# EAGLE design vca2 (EAGLE 9.4.2)
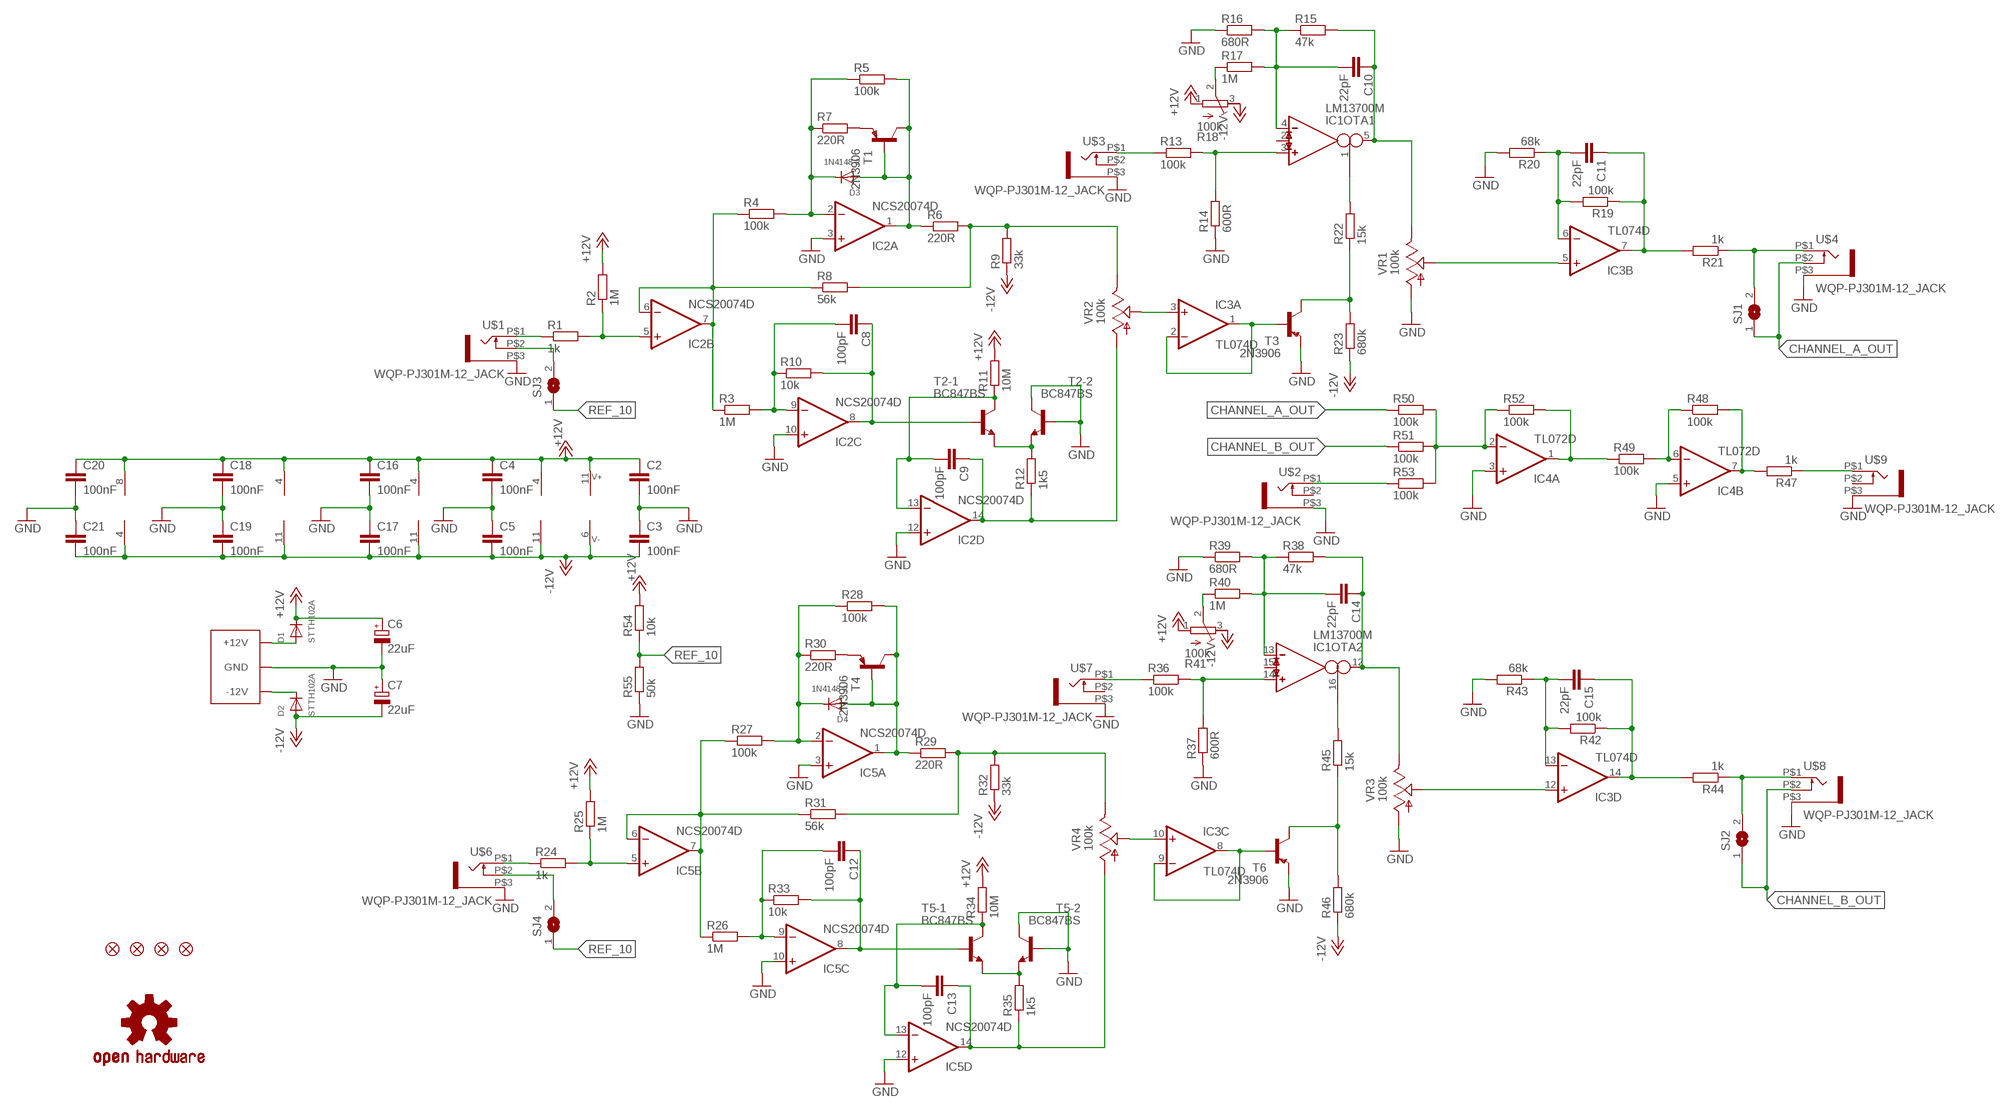
[diagram p0: schematic, sheet 1]

## Parts
C1  EURO_POWER_LOCKFAT-LOCK  [EURO_PWR_HEADER_LOCK]
C2  100nF  C-EUC0603  [C0603]
C3  100nF  C-EUC0603  [C0603]
C4  100nF  C-EUC0603  [C0603]
C5  100nF  C-EUC0603  [C0603]
C6  22uF  CPOL-EUC  [PANASONIC_C]
C7  22uF  CPOL-EUC  [PANASONIC_C]
C8  100pF  C-EUC0603  [C0603]
C9  100pF  C-EUC0603  [C0603]
C10  22pF  C-EUC0603  [C0603]
C11  22pF  C-EUC0603  [C0603]
C12  100pF  C-EUC0603  [C0603]
C13  100pF  C-EUC0603  [C0603]
C14  22pF  C-EUC0603  [C0603]
C15  22pF  C-EUC0603  [C0603]
C16  100nF  C-EUC0603  [C0603]
C17  100nF  C-EUC0603  [C0603]
C18  100nF  C-EUC0603  [C0603]
C19  100nF  C-EUC0603  [C0603]
C20  100nF  C-EUC0603  [C0603]
C21  100nF  C-EUC0603  [C0603]
D1  STTH102A  DIODESMA  [SMADIODE]
D2  STTH102A  DIODESMA  [SMADIODE]
D3  1N4148-2  DIODESOD-123  [SOD-123]
D4  1N4148-2  DIODESOD-123  [SOD-123]
FD1  FIDUCIAL1X2  [FIDUCIAL-1X2]
FD2  FIDUCIAL1X2  [FIDUCIAL-1X2]
FD3  FIDUCIAL1X2  [FIDUCIAL-1X2]
FD4  FIDUCIAL1X2  [FIDUCIAL-1X2]
IC1  LM13700M  [SO16]
IC2  NCS20074D  [SO14]
IC3  TL074D  [SO14]
IC4  TL072D  [SO08]
IC5  NCS20074D  [SO14]
LOGO1  OSHW-LOGOM  [OSHW-LOGO-M]
R1  1k  R-EU_R0603  [R0603]
R2  1M  R-EU_R0603  [R0603]
R3  1M  R-EU_R0603  [R0603]
R4  100k  R-EU_R0603  [R0603]
R5  100k  R-EU_R0603  [R0603]
R6  220R  R-EU_R0603  [R0603]
R7  220R  R-EU_R0603  [R0603]
R8  56k  R-EU_R0603  [R0603]
R9  33k  R-EU_R0603  [R0603]
R10  10k  R-EU_R0603  [R0603]
R11  10M  R-EU_R0603  [R0603]
R12  1k5  R-EU_R0603  [R0603]
R13  100k  R-EU_R0603  [R0603]
R14  600R  R-EU_R0603  [R0603]
R15  47k  R-EU_R0603  [R0603]
R16  680R  R-EU_R0603  [R0603]
R17  1M  R-EU_R0603  [R0603]
R18  100k  R-TRIMM64W  [RTRIM64W]
R19  100k  R-EU_R0603  [R0603]
R20  68k  R-EU_R0603  [R0603]
R21  1k  R-EU_R0603  [R0603]
R22  15k  R-EU_R0603  [R0603]
R23  680k  R-EU_R0603  [R0603]
R24  1k  R-EU_R0603  [R0603]
R25  1M  R-EU_R0603  [R0603]
R26  1M  R-EU_R0603  [R0603]
R27  100k  R-EU_R0603  [R0603]
R28  100k  R-EU_R0603  [R0603]
R29  220R  R-EU_R0603  [R0603]
R30  220R  R-EU_R0603  [R0603]
R31  56k  R-EU_R0603  [R0603]
R32  33k  R-EU_R0603  [R0603]
R33  10k  R-EU_R0603  [R0603]
R34  10M  R-EU_R0603  [R0603]
R35  1k5  R-EU_R0603  [R0603]
R36  100k  R-EU_R0603  [R0603]
R37  600R  R-EU_R0603  [R0603]
R38  47k  R-EU_R0603  [R0603]
R39  680R  R-EU_R0603  [R0603]
R40  1M  R-EU_R0603  [R0603]
R41  100k  R-TRIMM64W  [RTRIM64W]
R42  100k  R-EU_R0603  [R0603]
R43  68k  R-EU_R0603  [R0603]
R44  1k  R-EU_R0603  [R0603]
R45  15k  R-EU_R0603  [R0603]
R46  680k  R-EU_R0603  [R0603]
R47  1k  R-EU_R0603  [R0603]
R48  100k  R-EU_R0603  [R0603]
R49  100k  R-EU_R0603  [R0603]
R50  100k  R-EU_R0603  [R0603]
R51  100k  R-EU_R0603  [R0603]
R52  100k  R-EU_R0603  [R0603]
R53  100k  R-EU_R0603  [R0603]
R54  10k  R-EU_R0603  [R0603]
R55  50k  R-EU_R0603  [R0603]
SJ1  SJ  [SJ]
SJ2  SJ  [SJ]
SJ3  SJ  [SJ]
SJ4  SJ  [SJ]
T1  2N3906  MMBT3906LT1-PNP-SOT23-BEC  [SOT23-BEC]
T2  BC847BS  [SOT363]
T3  2N3906  MMBT3906LT1-PNP-SOT23-BEC  [SOT23-BEC]
T4  2N3906  MMBT3906LT1-PNP-SOT23-BEC  [SOT23-BEC]
T5  BC847BS  [SOT363]
T6  2N3906  MMBT3906LT1-PNP-SOT23-BEC  [SOT23-BEC]
U$1  WQP-PJ301M-12_JACK  [WQP-PJ301M-12_JACK]
U$2  WQP-PJ301M-12_JACK  [WQP-PJ301M-12_JACK]
U$3  WQP-PJ301M-12_JACK  [WQP-PJ301M-12_JACK]
U$4  WQP-PJ301M-12_JACK  [WQP-PJ301M-12_JACK]
U$6  WQP-PJ301M-12_JACK  [WQP-PJ301M-12_JACK]
U$7  WQP-PJ301M-12_JACK  [WQP-PJ301M-12_JACK]
U$8  WQP-PJ301M-12_JACK  [WQP-PJ301M-12_JACK]
U$9  WQP-PJ301M-12_JACK  [WQP-PJ301M-12_JACK]
VR1  100k  9MM_SNAP-IN_POT_  [9MM_SNAP-IN_POT]
VR2  100k  9MM_SNAP-IN_POT_  [9MM_SNAP-IN_POT]
VR3  100k  9MM_SNAP-IN_POT_  [9MM_SNAP-IN_POT]
VR4  100k  9MM_SNAP-IN_POT_  [9MM_SNAP-IN_POT]

## Nets
+12V [power]: C2.1 C4.1 C6.+ C16.1 C18.1 C20.1 D1.C IC1.11(SUPPLY:V+) IC2.4(P:V+) IC3.4(P:V+) IC4.8(P:V+) IC5.4(P:V+) R2.2 R11.2 R18.1(A) R25.2 R34.2 R41.1(A) R54.2
-12V [power]: C3.2 C5.2 C7.- C17.2 C19.2 C21.2 D2.A IC1.6(SUPPLY:V-) IC2.11(P:V-) IC3.11(P:V-) IC4.4(P:V-) IC5.11(P:V-) R9.1 R18.3(E) R23.1 R32.1 R41.3(E) R46.1
CHANNEL_A: R21.1 SJ1.2 U$4.P$1
CHANNEL_A_OUT: R50.1 SJ1.1 U$4.P$2
CHANNEL_B: R44.1 SJ2.2 U$8.P$1
CHANNEL_B_OUT: R51.1 SJ2.1 U$8.P$2
GND [power]: C1.GND1(GND) C1.GND2(GND) C1.GND3(GND) C1.GND4(GND) C1.GND5(GND) C1.GND6(GND) C2.2 C3.1 C4.2 C5.1 C6.- C7.+ C16.2 C17.1 C18.2 C19.1 C20.2 C21.1 IC2.3(A:+IN) IC2.10(C:+IN) IC2.12(D:+IN) IC4.3(A:+IN) IC4.5(B:+IN) IC5.3(A:+IN) IC5.10(C:+IN) IC5.12(D:+IN) R14.1 R16.1 R20.2 R37.1 R39.1 R43.2 R55.1 T2.3(-2:C) T2.5(-2:B) T3.E T5.3(-2:C) T5.5(-2:B) T6.E U$1.P$3 U$2.P$3 U$3.P$3 U$4.P$3 U$6.P$3 U$7.P$3 U$8.P$3 U$9.P$3 VR1.1(A) VR3.1(A)
N$1: IC2.5(B:+IN) R1.2 R2.1
N$2: C8.2 IC2.9(C:-IN) R3.2 R10.1
N$3: IC2.6(B:-IN) IC2.7(B:OUT) R3.1 R4.1 R8.1
N$4: R1.1 U$1.P$1
N$5: C8.1 IC2.8(C:OUT) R10.2 T2.2(-1:B)
N$6: C9.2 IC2.13(D:-IN) R11.1 T2.6(-1:C)
N$7: R6.2 R8.2 R9.2 VR2.3(E)
N$8: R7.2 T1.E
N$9: D3.A IC2.1(A:OUT) R5.2 R6.1 T1.B T1.C
N$10: C10.2 IC1.4(OTA1:IN_N) R15.1 R16.2 R17.2
N$11: D3.C IC2.2(A:-IN) R4.2 R5.1 R7.1
N$12: R12.2 T2.1(-1:E) T2.4(-2:E)
N$13: C9.1 IC2.14(D:OUT) R12.1 VR2.1(A)
N$14: R13.1 U$3.P$1
N$15: IC1.3(OTA1:IN_P) R13.2 R14.2
N$16: R47.1 U$9.P$1
N$17: C10.1 IC1.5(OTA1:OUT) R15.2 VR1.3(E)
N$18: R17.1 R18.2(S)
N$19: IC3.5(B:+IN) VR1.2(S)
N$20: C11.2 IC3.6(B:-IN) R19.2 R20.1
N$21: IC5.5(B:+IN) R24.2 R25.1
N$22: C11.1 IC3.7(B:OUT) R19.1 R21.2
N$23: IC3.1(A:OUT) IC3.2(A:-IN) T3.B
N$24: IC3.3(A:+IN) VR2.2(S)
N$25: IC1.1(OTA1:I_BIAS) R22.2
N$26: R22.1 R23.2 T3.C
N$27: C12.2 IC5.9(C:-IN) R26.2 R33.1
N$28: IC5.6(B:-IN) IC5.7(B:OUT) R26.1 R27.1 R31.1
N$29: R24.1 U$6.P$1
N$30: R29.2 R31.2 R32.2 VR4.3(E)
N$31: R30.2 T4.E
N$32: D4.A IC5.1(A:OUT) R28.2 R29.1 T4.B T4.C
N$33: D4.C IC5.2(A:-IN) R27.2 R28.1 R30.1
N$34: C12.1 IC5.8(C:OUT) R33.2 T5.2(-1:B)
N$35: R35.2 T5.1(-1:E) T5.4(-2:E)
N$36: C13.2 IC5.13(D:-IN) R34.1 T5.6(-1:C)
N$37: C13.1 IC5.14(D:OUT) R35.1 VR4.1(A)
N$38: R36.1 U$7.P$1
N$39: IC1.14(OTA2:IN_P) R36.2 R37.2
N$40: C14.2 IC1.13(OTA2:IN_N) R38.1 R39.2 R40.2
N$41 [power]: C1.NEG1(-12V) C1.NEG2(-12V) D2.C
N$42 [power]: C1.POS1(+12V) C1.POS2(+12V) D1.A
N$43: C14.1 IC1.12(OTA2:OUT) R38.2 VR3.3(E)
N$44: R40.1 R41.2(S)
N$45: C15.2 IC3.13(D:-IN) R42.2 R43.1
N$46: IC3.12(D:+IN) VR3.2(S)
N$47: C15.1 IC3.14(D:OUT) R42.1 R44.2
N$48: IC4.6(B:-IN) R48.1 R49.2
N$49: IC3.8(C:OUT) IC3.9(C:-IN) T6.B
N$50: IC3.10(C:+IN) VR4.2(S)
N$51: IC1.16(OTA2:I_BIAS) R45.2
N$52: R45.1 R46.2 T6.C
N$53: IC4.1(A:OUT) R49.1 R52.2
N$54: IC4.7(B:OUT) R47.2 R48.2
N$55: IC4.2(A:-IN) R50.2 R51.2 R52.1 R53.2
N$56: SJ3.2 U$1.P$2
N$57: R53.1 U$2.P$1
N$58: SJ4.2 U$6.P$2
REF_10: R54.1 R55.2 SJ3.1 SJ4.1
Unconnected: IC1.2(OTA1:I_DIODE) IC1.7(BUF1:B) IC1.8(BUF1:E) IC1.9(BUF2:E) IC1.10(BUF2:B) IC1.15(OTA2:I_DIODE) U$2.P$2 U$3.P$2 U$7.P$2 U$9.P$2

## Library data of the parts
C1 = MusicThingModular:EURO_POWER_LOCK
C2-C5 C8-C21 = rcl:C-EU: CAPACITOR, European symbol; SPICEPREFIX: C
C6 C7 = rcl:CPOL-EU: POLARIZED CAPACITOR, European symbol; SPICEPREFIX: C
D1-D4 = adafruit:DIODE: Diode SMADIODE - SMA Surface Mount Package 20V 1A Schottky Diode Digikey: 641-1014-6-ND DO-1N4148 - Through Hole Small Current Diode SOD-123 20V 1 A (.5mV Vf) Schottky Diode - Digikey: MBRX120TPMSCT-ND SOD-323 10V 570mA (.38mV Vf, 3ns) Schottky Diode - Digikey: ZLLS410CT-ND SOD-523 30V 30mA Schottky Diode (RB751S-40TE61) - Digikey: RB751S-40TE61CT-ND SOT23-R/W - SOT23 Package (R = Solder Paste/Reflow Ovens, W = Hand-Soldering) BAT54Film 40V 300mA - Digikey: 497-7162-1-ND
FD1-FD4 = SparkFun-Aesthetics:FIDUCIAL: Fiducial Alignment Points Point-of-reference for pick-and-place machines and other optical instruments.
IC1 = ota:LM13700: Dual OTA with buffers
IC2 IC5 = ncs20074:NCS20074: OP AMP
IC3 = linear:TL074: OP AMP
IC4 = linear:TL072: OP AMP
LOGO1 = SparkFun-Aesthetics:OSHW-LOGO: Open-Source Hardware (OSHW) Logo This logo indicates the piece of hardware it is found on incorporates a OSHW license and/or adheres to the definition of open source hardware found here: http://freedomdefined.org/OSHW
R1-R17 R19-R40 R42-R55 = rcl:R-EU_: RESISTOR, European symbol; SPICEPREFIX: R
R18 R41 = rcl:R-TRIMM: Trimm resistor; SPICEMODEL: X; SPICEPREFIXL: POT
SJ1-SJ4 = jumper:SJ: SMD solder JUMPER
T1 T3 T4 T6 = transistor-neu-to92:*-PNP-: PNP Transistror
T2 T5 = nxp_60:BC847BS: NPN/NPN general-purpose transistor pair in a very small SOT363 (SC-88) Surface-Mounted Device (SMD) plastic package. AAL Eindhoven MK
U$1-U$4 U$6-U$9 = thonkiconn:WQP-PJ301M-12_JACK
VR1-VR4 = MusicThingModular:9MM_SNAP-IN_POT: 9mm vertical snap-in pot, Alpha / Panasonic style

## Net classes
1 power: width 0.381 mm

## Board
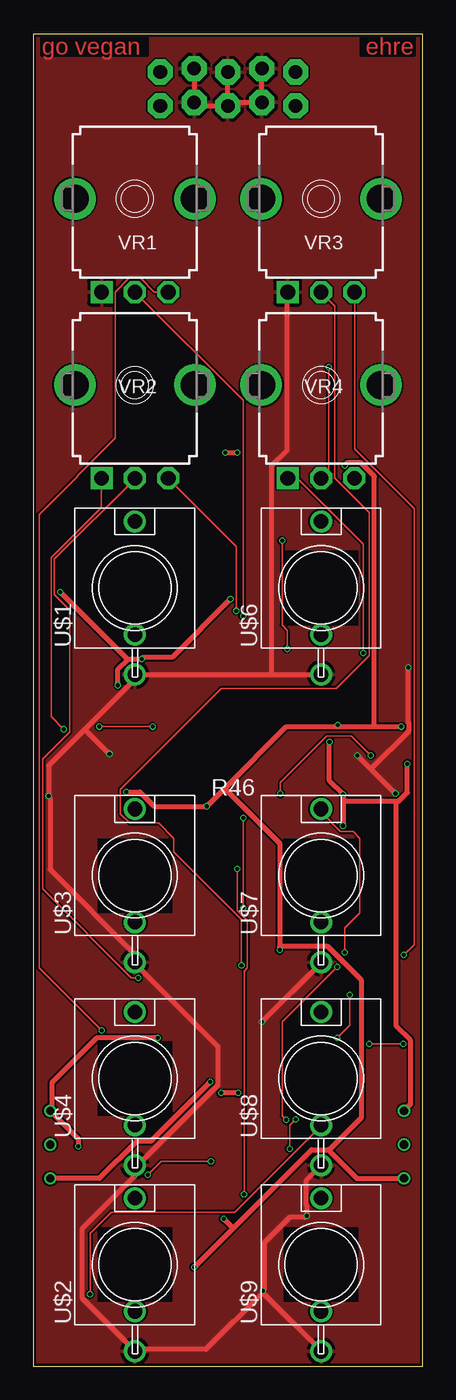
[diagram p1: board, top side]
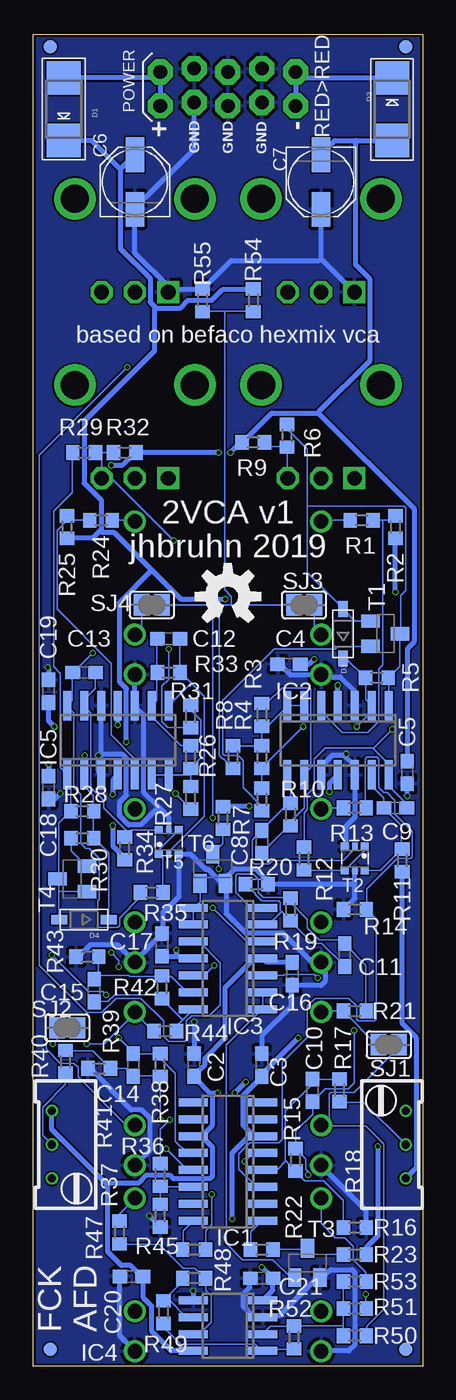
[diagram p2: board, bottom side, seen from below]

Size 29.21 x 100 mm. Coordinates in mm from the lower left corner, seen from the top.
Outline: 0,0 29.21,0 29.21,100 0,100 0,0
Copper layers (1*16): Top 0.035559375mm / dielectric 1.6mm / Bottom 0.035559375mm
Design rules "jlcpcb2layer": minimum track width 5mil, minimum drill 12mil, track to track 5mil, track to pad 5mil, pad to pad 5mil, via to via 5mil, smd to smd 5mil, copper to edge 8mil, drill to drill 6mil, minimum pad ring 5mil, minimum via ring 3mil, stop-mask expansion 2.5mil, vias tented up to drill 0mil, thermal gap 10mil

### Footprints (pad centres in the part's own frame; a part is rotated, then mirrored left to right if it is on the bottom)
EURO_PWR_HEADER_LOCK = drill 1.016 pad 1.88 octagon: GND1 -2.54,1.143; GND2 -2.54,-1.397; GND3 0,1.397; GND4 0,-1.143; GND5 2.54,1.143; GND6 2.54,-1.397; NEG1 -5.08,1.397; NEG2 -5.08,-1.143; POS1 5.08,1.397; POS2 5.08,-1.143
C0603 = smd 1.1 x 1: 1 -0.85,0; 2 0.85,0
PANASONIC_C = smd 2.6 x 1.4: + 2.05,0; - -2.05,0
SMADIODE = smd 2.54 x 2.54: A 2.349,0; C -2.349,0
SOD-123 = smd 1.2 x 0.7: A 1.85,0; C -1.85,0
FIDUCIAL-1X2 = smd 1 x 1: 1 0,0
SO16 = smd 0.6 x 2.2: 1 -4.445,-2.6; 2 -3.175,-2.6; 3 -1.905,-2.6; 4 -0.635,-2.6; 5 0.635,-2.6; 6 1.905,-2.6; 7 3.175,-2.6; 8 4.445,-2.6; 9 4.445,2.6; 10 3.175,2.6; 11 1.905,2.6; 12 0.635,2.6; 13 -0.635,2.6; 14 -1.905,2.6; 15 -3.175,2.6; 16 -4.445,2.6
SO14 = smd 0.6 x 2.2: 1 -3.81,-2.6; 2 -2.54,-2.6; 3 -1.27,-2.6; 4 0,-2.6; 5 1.27,-2.6; 6 2.54,-2.6; 7 3.81,-2.6; 8 3.81,2.6; 9 2.54,2.6; 10 1.27,2.6; 11 0,2.6; 12 -1.27,2.6; 13 -2.54,2.6; 14 -3.81,2.6
SO08 = smd 0.6 x 2.2: 1 -1.905,-2.6; 2 -0.635,-2.6; 3 0.635,-2.6; 4 1.905,-2.6; 5 1.905,2.6; 6 0.635,2.6; 7 -0.635,2.6; 8 -1.905,2.6
R0603 = smd 1 x 1.1: 1 -0.85,0; 2 0.85,0
RTRIM64W = drill 0.61: 1 1.27,-2.54; 2 1.27,0; 3 1.27,2.54
SJ = smd 1.168 x 1.6: 1 -0.762,0; 2 0.762,0
SOT23-BEC = smd 1 x 1.4: B -0.95,-1.1; C 0,1.1; E 0.95,-1.1
SOT363 = smd 0.6 x 0.6: 1 -0.75,-0.9; 3 0.75,-0.9; 4 0.75,0.9; 6 -0.75,0.9 | smd 0.4 x 0.6: 2 0,-0.9; 5 0,0.9
WQP-PJ301M-12_JACK = drill 1.1: P$1 0,5; P$2 0,-3.5; P$3 0,-6.5
9MM_SNAP-IN_POT = drill 1.1 square: 1 -2.5,-7 | drill 1.1 octagon: 2 0,-7; 3 2.5,-7 | drill 2.1 pad 2.794: CHASSIS1 -4.5,0; CHASSIS2 4.5,0

### Placement (x,y rotation side)
C1  14.61,96.01 180 bottom
C2  17.14,22.61 90 bottom
C3  12.06,22.61 270 bottom
C4  10.03,52.7 180 bottom
C5  1.14,44.58 90 bottom
C6  21.59,88.9 90 bottom
C7  7.62,88.9 270 bottom
C8  12.06,39.37 270 bottom
C9  2.03,41.91 180 bottom
C10  8.26,20.7 90 bottom
C11  5.84,30.86 270 bottom
C12  19.05,54.61 180 bottom
C13  25.4,52.07 0 bottom
C14  21.72,22.61 270 bottom
C15  24.64,28.19 90 bottom
C16  9.78,29.46 270 bottom
C17  19.56,31.62 270 bottom
C18  28.07,43.43 270 bottom
C19  28.07,50.67 270 bottom
C20  21.84,6.73 180 bottom
C21  12.06,6.6 0 bottom
D1  26.92,94.36 90 bottom
D2  2.29,94.36 270 bottom
D3  5.97,54.99 90 bottom
D4  25.4,33.53 180 bottom
FD1  1.27,99.06 0 bottom
FD2  27.94,99.06 0 bottom
FD3  1.27,1.27 0 bottom
FD4  27.94,1.27 0 bottom
IC1  14.61,15.37 90 bottom
IC2  6.35,46.99 180 bottom
IC3  14.61,30.61 90 bottom
IC4  14.61,3.05 90 bottom
IC5  22.86,46.99 0 bottom
LOGO1  14.61,57.78 0 bottom
R1  4.57,63.5 0 bottom
R2  2.03,62.99 270 bottom
R3  12.06,48.9 90 bottom
R4  12.06,45.72 270 bottom
R5  3.43,51.69 0 bottom
R6  10.16,69.85 270 bottom
R7  12.06,42.55 270 bottom
R8  14.22,45.72 270 bottom
R9  12.7,69.34 0 bottom
R10  9.91,41.4 90 bottom
R11  1.52,37.97 270 bottom
R12  8.89,38.1 270 bottom
R13  5.08,41.91 0 bottom
R14  5.08,34.29 0 bottom
R15  9.53,15.49 90 bottom
R16  5.08,10.41 180 bottom
R17  6.22,20.7 90 bottom
R18  2.54,16.64 0 bottom
R19  9.91,34.29 270 bottom
R20  12.45,36.2 0 bottom
R21  5.08,26.67 0 bottom
R22  12.06,8.76 180 bottom
R23  5.08,8.38 180 bottom
R24  24.13,63.5 180 bottom
R25  26.67,62.99 270 bottom
R26  17.4,45.72 90 bottom
R27  17.4,42.67 270 bottom
R28  25.53,41.66 180 bottom
R29  25.4,68.58 0 bottom
R30  25.53,39.62 180 bottom
R31  17.4,48.77 270 bottom
R32  22.35,68.58 180 bottom
R33  19.05,52.07 0 bottom
R34  22.35,38.86 270 bottom
R35  20.32,35.56 0 bottom
R36  19.68,14.35 270 bottom
R37  19.68,11.3 90 bottom
R38  19.68,22.61 90 bottom
R39  24.26,22.35 0 bottom
R40  26.8,22.86 90 bottom
R41  26.54,16.64 180 bottom
R42  19.56,28.45 90 bottom
R43  25.15,30.73 180 bottom
R44  19.3,25.15 0 bottom
R45  17.14,8.76 180 bottom
R46  14.99,41.15 270 bottom
R47  22.73,10.03 270 bottom
R48  17.14,6.6 0 bottom
R49  19.43,4.06 90 bottom
R50  5.08,2.29 180 bottom
R51  5.08,4.32 180 bottom
R52  9.65,2.16 270 bottom
R53  5.08,6.35 180 bottom
R54  12.7,80.01 90 bottom
R55  16.51,80.01 270 bottom
SJ1  2.54,24.13 180 bottom
SJ2  26.67,25.4 180 bottom
SJ3  8.89,57.15 0 bottom
SJ4  20.32,57.15 180 bottom
T1  2.79,54.99 270 bottom
T2  5.08,38.1 180 bottom
T3  8.64,7.75 0 bottom
T4  26.29,36.58 90 bottom
T5  19.05,39.37 0 bottom
T6  15.75,37.34 0 bottom
U$1  7.62,58.42 0 top
U$2  7.62,7.62 0 top
U$3  7.62,36.83 0 top
U$4  7.62,21.59 0 top
U$6  21.59,58.42 0 top
U$7  21.59,36.83 0 top
U$8  21.59,21.59 0 top
U$9  21.59,7.62 0 top
VR1  7.62,87.63 0 top
VR2  7.62,73.66 0 top
VR3  21.59,87.63 0 top
VR4  21.59,73.66 0 top

### Tracks (layer width: path | path; a pad name or v marks a point on that pad's centre or on a via)
+12V  (via drill 0.3)
  Top 0.381: 7.11,53.09 v8.13,53.09 8.26,53.21 10.41,53.21 v14.8,57.59 | 7.11,53.09 6.35,52.32 v6.35,51.12 | v2.03,58.1 6.99,53.15 7.11,53.09 | 23.24,42.42 v23.24,42.93 22.23,43.94 v22.23,46.86 | 23.24,42.42 v23.24,40.58 | v28.07,45.21 28.07,43.05 27.43,42.42 27.24,42.42 | 23.24,42.42 27.24,42.42 | 27.24,42.42 27.24,25.53 28.32,24.45 28.32,19.68 R41.1 | R18.1 4.95,14.1 7.75,16.89 8.83,16.89 v13.27,21.34 | v15.37,20.51 v14.1,20.51
  Bottom 0.381: C4.1 8.51,52.7 v8.13,53.09 | IC2.4 v6.35,51.12 | v2.03,58.1 R2.2 | 20,79.44 18.16,79.44 17.59,80.01 15.81,80.01 14.99,80.83 12.7,80.83 R54.2 | 20,79.44 20.45,79.88 20.45,81.66 22.67,83.88 22.67,89.85 | 22.67,89.85 21.59,90.93 C6.+ | 24.19,62.74 24.13,62.8 24.13,65.02 25.4,66.29 25.4,70.93 20.13,76.2 20.13,79.31 20,79.44 | 24.19,62.74 24.77,62.17 26.67,62.17 R25.2 | D1.C 24.83,92.01 22.67,89.85 | v14.8,57.59 18.16,57.59 20.32,59.75 | 20.32,59.75 23.18,62.61 24.07,62.61 24.19,62.74 | R11.2 1.52,25.72 0.45,24.64 0.45,14.92 R18.1 | C16.1 9.78,30.35 11.75,30.35 IC3.4 12.19,30.54 12.7,30.54 14.8,28.45 14.8,24.64 16.32,23.11 16.32,22.67 17.08,21.91 C2.1 17.14,21.72 15.81,20.38 | 15.81,20.38 15.75,20.32 15.75,18.1 16.57,17.27 IC1.11 16.45,17.14 15.75,16.45 15.75,14.29 15.94,14.1 18.73,14.1 18.99,14.35 20.7,14.35 21.27,13.78 23.56,13.78 23.69,13.65 | R34.2 22.35,38.16 23.24,39.05 v23.24,40.58 | v23.24,42.93 23.24,44.01 IC5.4 | v28.07,45.21 C18.1 | IC4.8 18.86,1.14 20.32,2.6 20.32,4.51 20.95,5.14 20.95,6.73 C20.1 21.14,6.79 21.91,7.56 22.61,7.56 23.62,8.57 23.62,13.59 23.69,13.65 | R41.1 27.81,17.78 23.69,13.65 | v14.1,20.51 v13.27,21.34 | v15.37,20.51 15.68,20.51 15.81,20.38 | 20.32,59.75 22.73,57.34 22.73,51.37 22.23,50.86 v22.23,46.86
-12V  (via drill 0.3)
  Top 0.381: v14.41,68.58 v15.3,68.58 | v6.99,43.12 8,43.12 9.08,42.04 v13.02,42.04 14.35,43.37 | 22.86,48.01 18.99,48.01 14.35,43.37 | 22.86,48.01 25.59,48.01 | 25.59,48.01 v27.62,48.01 | v22.86,48.13 22.86,48.01 | 18.48,31.5 18.48,39.24 14.35,43.37 | 18.48,31.5 v18.48,31.24 | v3.37,16.51 3.37,17.08 R18.3 1.4,19.3 1.4,21.27 4.76,24.64 v9.34,24.64 | R41.3 24.26,14.1 22.16,16.19 | 22.16,16.19 22.1,16.26 20.89,16.26 14.99,10.35 | v12.06,7.43 14.99,10.35 | 14.99,10.35 v14.29,11.05 | 18.48,31.5 22.1,31.5 24.64,28.96 24.64,18.67 22.16,16.19 | v23.37,67.63 23.56,67.82 24.57,67.82 25.59,66.8 25.59,48.01
  Bottom 0.381: 5.02,92.01 6.6,92.01 7.62,91 C7.- | 5.02,92.01 D2.A | C5.2 1.14,53.85 0.64,54.36 0.64,64.39 7.81,71.56 | 7.81,71.56 11.3,71.56 13.53,69.34 R9.1 13.72,69.28 v14.41,68.58 | v15.3,68.58 R32.1 21.65,68.52 22.54,67.63 v23.37,67.63 | 5.02,92.01 5.02,82.68 3.94,81.6 3.94,75.5 7.75,71.69 7.81,71.56 | 18.48,30.73 17.34,30.73 IC3.11 | 18.48,30.73 19.56,30.73 C17.2 | v13.02,42.04 14.99,42.04 R46.1 | v6.99,43.12 6.99,43.75 IC2.11 | C19.2 28.07,48.45 v27.62,48.01 | v22.86,48.13 IC5.11 | v18.48,31.24 18.48,30.73 | v3.37,16.51 3.37,9.78 4.19,8.95 4.19,8.38 R23.1 | IC4.4 11.24,5.71 11.24,6.6 C21.2 11.37,6.73 v12.06,7.43 | v14.29,11.05 14.29,16 12.95,17.34 IC1.6 12.64,17.27 13.46,18.1 13.46,20.32 12.06,21.72 C3.2 12.06,21.91 v9.34,24.64
CHANNEL_A
  Bottom 0.127: 5.97,26.67 7.56,26.67 7.62,26.61 U$4.P$1 | SJ1.2 3.43,24.13 5.97,26.67 | 5.97,26.67 R21.1
CHANNEL_A_OUT
  Bottom 0.127: 6.99,18.03 7.62,18.03 U$4.P$2 6.99,18.03 | 6.99,18.03 4.25,18.03 2.92,16.7 2.92,4.25 4.19,2.98 4.19,2.29 R50.1 | SJ1.1 1.78,23.94 5.14,20.57 6.86,20.57 6.99,20.45 6.99,18.03
CHANNEL_B  (via drill 0.3)
  Top 0.127: v25.21,24.19 v27.75,24.19
  Bottom 0.127: R44.1 20.19,25.15 21.59,26.54 U$8.P$1 21.59,26.48 23.88,24.19 v25.21,24.19 | SJ2.2 27.43,24.51 v27.75,24.19
CHANNEL_B_OUT  (via drill 0.3)
  Top 0.127: v4.25,5.4 4.25,9.97 5.84,11.56 15.11,11.56 21.59,18.03 U$8.P$2
  Bottom 0.127: v4.25,5.4 4.25,4.32 R51.1 | SJ2.1 25.91,25.59 26.73,26.42 28.13,26.42 28.26,26.29 28.26,23.81 27.18,22.73 26.16,22.73 25.84,22.42 25.84,21.72 22.23,18.1 U$8.P$2
GND  (via drill 0.3)
  Top 0.381: 17.21,5.52 v17.21,5.65 17.34,5.78 17.34,9.27 19.24,11.18 20.38,11.18 v20.51,11.3 20.51,12.06 20.45,12.13 20.45,13.91 21.59,15.05 U$8.P$3 | 17.21,5.52 21.59,1.14 U$9.P$3 | 17.21,5.52 12.95,1.27 7.75,1.27 U$2.P$3 7.62,1.14 3.68,5.08 3.68,10.35 7.62,14.29 U$4.P$3 7.75,15.18 7.94,15.18 13.84,21.08 13.84,24 7.68,30.16 U$3.P$3 7.62,30.92 1.27,37.27 1.27,42.67 v1.14,42.8 1.14,45.09 3.87,47.82 | C1.GND2 C1.GND1 12.32,94.61 C1.GND3 | C1.GND3 14.86,94.87 C1.GND5 C1.GND6 | C1.GND4 14.61,95.12 14.73,95 C1.GND3 | v17.14,25.84 21.59,30.29 U$7.P$3 | v24.32,45.85 25.34,44.83 | 25.34,44.83 v27.18,42.99 | v28.13,52.45 28.13,48.32 28.19,48.26 28.19,47.69 25.34,44.83 | 3.87,47.82 7.62,51.56 U$1.P$3 7.75,51.94 17.91,51.94 | 3.87,47.82 v5.71,45.97 | 17.91,51.94 21.59,51.94 U$6.P$3 | 17.91,51.94 17.91,67.63 19.05,68.77 19.05,80.58 VR3.1
  Bottom 0.381: R16.1 4.25,10.41 4.25,11.68 7.62,15.05 U$4.P$3 | C21.1 12.95,6.6 12.95,5.91 13.46,5.4 13.46,4.51 12.64,3.68 IC4.3 11.87,3.81 10.73,3.81 7.94,6.6 7.75,6.6 T3.E 7.49,6.67 6.92,7.24 5.27,7.24 5.08,7.05 5.08,1.59 5.52,1.14 7.62,1.14 U$2.P$3 | C20.2 22.73,6.73 22.73,2.29 21.59,1.14 U$9.P$3 | v17.21,5.65 IC4.5 | v20.51,11.3 19.68,10.48 R37.1 | R39.1 24.96,22.35 21.84,19.24 21.08,19.24 20.45,18.61 20.45,16.26 21.59,15.11 U$8.P$3 | 7.62,83.12 C7.+ | 7.62,83.12 5.14,80.64 VR1.1 | 7.62,83.12 7.75,83 14.35,83 16.38,80.96 R55.1 16.51,80.83 18.86,80.83 19.05,80.64 VR3.1 18.99,80.96 21.59,83.57 C6.- 21.53,87 17.14,91.38 C1.GND5 | v17.14,25.84 C2.2 | R43.2 25.84,30.73 24.96,31.62 22.86,31.62 21.59,30.35 U$7.P$3 21.53,30.48 19.56,32.45 C17.1 19.49,32.64 19.49,34.04 18.29,35.24 18.29,38.23 T5.3 18.29,38.42 17.4,38.42 16.26,37.27 16.07,37.27 15.05,36.26 14.86,36.26 T6.E | C3.1 12.06,24.83 9.91,26.99 9.91,28.45 C16.2 9.78,28.57 7.62,28.57 7.3,28.89 7.3,29.97 7.62,30.29 U$3.P$3 7.75,30.42 8.38,30.42 10.48,32.51 13.27,32.51 14.73,33.97 14.73,36.07 T6.E | 5.08,36.2 5.08,35.12 5.91,34.29 R14.1 | 5.08,36.2 T2.5 | T6.E 14.67,36.39 14.67,36.77 14.1,37.34 12.51,37.34 11.62,36.45 11.62,36.2 R20.2 5.08,36.2 | v27.18,42.99 27.56,42.61 28.07,42.61 C18.2 | IC5.3 24.13,44.45 24.32,44.64 v24.32,45.85 24.13,46.04 | C19.1 28.07,52.39 v28.13,52.45 | 24.13,46.04 IC5.12 | T5.5 19.05,41.21 19.81,41.97 | 19.81,41.97 20.95,43.12 20.95,48.9 21.59,49.53 IC5.10 U$6.P$3 | 19.81,41.97 21.14,40.64 22.04,40.64 22.73,41.34 22.73,42.35 22.23,42.86 22.23,45.66 22.48,45.91 24,45.91 24.13,46.04
  Bottom 0.381: T2.3 5.78,39.05 5.78,40.51 5.08,41.21 IC2.12 5.14,44.58 5.14,45.09 5.91,45.85 | IC2.10 7.62,45.02 6.79,45.85 5.91,45.85 | v1.14,42.8 C5.1 | C4.2 10.73,52.7 9.91,51.88 7.62,51.88 U$1.P$3 7.49,51.75 6.16,51.75 5.08,50.67 IC2.3 | v5.71,45.97 5.78,45.97 5.91,45.85
  pour Top: -5.08,101.6 -5.08,-2.54 31.11,-2.54 31.11,101.6
  pour Bottom: -10.16,104.14 -10.16,-6.99 38.1,-6.99 40.01,-5.08 40.01,104.78 38.1,106.68 -7.62,106.68
N$1
  Bottom 0.127: 2.98,63.5 2.35,63.5 2.03,63.82 R2.1 | 2.98,63.5 R1.2 | 2.98,63.5 2.98,52.64 3.3,52.32 3.3,48.39 4.13,47.56 6.03,47.56 7.62,49.15 IC2.5
N$2
  Bottom 0.127: C8.2 12.06,38.54 10.1,40.51 9.91,40.51 R10.1 9.91,40.89 8.89,41.91 IC2.9 8.89,44.45 8.38,44.96 8.38,50.8 8.51,50.93 10.54,50.93 11.68,49.78 12.06,49.78 R3.2
N$3
  Bottom 0.127: R8.1 14.22,46.55 12.06,46.55 R4.1 R3.1 12.06,48.07 11.62,48.07 10.16,49.53 IC2.7 IC2.6
N$4
  Bottom 0.127: R1.1 7.56,63.5 7.62,63.44 U$1.P$1
N$5
  Bottom 0.127: IC2.8 9.91,44.13 R10.2 9.91,42.23 10.1,42.23 12.06,40.26 C8.1 12.06,40.2 12.76,39.5 12.76,37.85 12.64,37.72 11.49,37.72 11.24,37.97 5.97,37.97 5.08,38.86 T2.2
N$6
  Bottom 0.127: T2.6 4.32,37.21 3.17,37.21 1.52,38.86 R11.1 1.59,38.86 1.59,40.58 2.92,41.91 | 2.92,41.91 2.92,42.67 3.81,43.56 IC2.13 | 2.92,41.91 C9.2
N$7  (via drill 0.3)
  Top 0.127: v15.24,56.71 15.24,61.53 10.16,66.61 VR2.3
  Bottom 0.127: R9.2 11.81,69.34 11.49,69.03 10.16,69.03 R6.2 10.16,66.67 VR2.3 | v15.24,56.71 15.24,45.85 14.99,45.59 14.92,45.59 14.22,44.9 R8.2
N$8
  Bottom 0.127: R7.2 12.06,42.04 13.46,43.43 13.46,45.47 13.84,45.85 14.86,45.85 14.99,45.97 14.99,49.97 11.11,53.85 6.54,53.85 6.35,54.04 3.94,54.04 T1.E
N$9
  Bottom 0.127: IC2.1 2.54,51.69 | 2.54,51.69 1.71,52.51 1.71,54.99 T1.C 1.65,54.99 1.65,57.85 1.27,58.23 1.27,64.45 1.4,64.58 8.64,64.58 | 2.54,51.69 R5.2 | R6.1 10.16,70.36 8.64,68.83 8.64,64.58 | 8.64,64.58 8.64,59.56 5.97,56.9 D3.A 5.08,55.94 3.94,55.94 T1.B
N$10
  Bottom 0.127: 8.26,21.53 6.22,21.53 R17.2 | R16.2 5.97,10.41 5.97,12.45 7.43,13.91 8.83,13.91 9.53,14.61 R15.1 9.53,14.67 10.26,15.4 | 8.26,21.53 8.26,21.21 10.29,19.18 10.29,15.43 10.26,15.4 | 8.26,21.53 C10.2 | IC1.4 10.92,14.73 10.26,15.4
N$11  (via drill 0.3)
  Top 0.127: v4.95,48.01 v8.95,48.01
  Bottom 0.127: R7.1 R4.2 12.06,44.9 v8.95,48.01 | D3.C 5.97,53.09 5.71,53.09 4.32,51.69 R5.1 4.25,51.69 4.25,50.04 IC2.2 3.81,49.15 v4.95,48.01
N$12
  Bottom 0.127: T2.1 4.38,38.99 4.38,38.67 5.84,37.21 T2.4 5.91,37.21 8.89,37.21 R12.2
N$13  (via drill 0.3)
  Top 0.127: v2.29,47.82 1.33,48.77 1.33,60.71 5.08,64.45 5.08,66.61 VR2.1
  Bottom 0.127: C9.1 1.21,41.91 1.21,42.23 2.54,43.56 IC2.14 2.54,45.21 3.71,46.39 | R12.1 8.89,41.53 8.64,41.78 8.64,42.93 8.13,43.43 8.13,45.59 7.3,46.42 3.75,46.42 3.71,46.39 | 3.71,46.39 v2.29,47.82
N$14
  Bottom 0.127: R13.1 7.56,41.91 7.62,41.85 U$3.P$1
N$15
  Bottom 0.127: 4.19,34.29 4.19,35.81 1.91,38.1 0.89,38.1 0.76,38.23 0.76,40.13 2.1,41.47 2.1,42.48 2.67,43.05 2.92,43.05 3.3,43.43 3.3,45.59 3.43,45.72 4.19,45.72 4.32,45.59 4.32,41.97 4.25,41.91 R13.2 | IC1.3 12.45,13.46 13.78,14.8 13.78,15.94 12.95,16.76 10.79,16.76 10.54,17.02 10.54,22.8 8.64,24.7 8.64,27.05 8.06,27.62 5.52,27.62 4.95,27.05 4.95,26.04 4.83,25.91 3.62,25.91 3.49,26.04 3.49,33.59 4.19,34.29 | 4.19,34.29 R14.2
N$16
  Bottom 0.127: R47.1 22.73,11.43 21.59,12.57 U$9.P$1
N$17  (via drill 0.3)
  Top 0.127: v13.34,15.37 9.59,15.37 v8.57,14.35 | v5.14,25.21 0.45,29.91 0.45,63.94 6.16,69.66 6.16,80.64 7.18,81.66 8.06,81.66 9.08,80.64 10.1,80.64 VR1.3
  Bottom 0.127: IC1.5 12.7,16 v13.34,15.37 | v8.57,14.35 8.57,14.61 8.76,14.8 8.76,15.56 9.53,16.32 R15.2 9.53,17.65 8.26,18.92 C10.1 8.26,19.88 7.3,20.83 5.59,20.83 5.14,21.27 v5.14,25.21
N$18
  Bottom 0.127: R18.2 4.45,19.81 6.22,19.81 R17.1
N$19  (via drill 0.3)
  Top 0.127: v15.75,41.15 v15.75,34.42 | v15.75,56.33 15.75,72.52 7.62,80.64 VR1.2
  Bottom 0.127: IC3.5 13.21,31.88 v15.75,34.42 | v15.75,56.33 v15.75,41.15
N$20
  Bottom 0.127: C11.2 5.84,30.04 7.56,31.75 8.26,31.75 9.91,33.4 R19.2 9.91,33.47 10.57,34.13 | 10.57,34.13 10.67,34.23 10.67,34.8 10.79,34.92 12.06,34.92 12.57,35.43 12.57,35.5 13.27,36.2 R20.1 | IC3.6 11.56,33.15 10.57,34.13
N$21
  Bottom 0.127: R24.2 26.35,63.5 26.67,63.82 R25.1 26.54,63.63 27.43,62.74 27.43,56.83 23.37,52.77 23.37,47.37 21.59,45.59 IC5.5
N$22
  Bottom 0.127: R21.2 4.25,26.67 4.25,30.1 5.84,31.69 C11.1 5.84,31.75 6.1,32 7.75,32 8.64,32.89 8.64,33.53 9.91,34.8 R19.1 9.91,35.18 11.94,35.18 12.32,35.56 12.32,36.58 12.7,36.96 13.91,36.96 14.03,36.83 14.03,35.56 12.89,34.42 IC3.7
N$23
  Bottom 0.127: T3.B 9.59,6.67 9.91,6.67 11.24,8 13.53,8 14.73,9.21 14.73,24.13 12.06,26.8 IC3.1 IC3.2
N$24  (via drill 0.3)
  Top 0.127: v7.87,29.15 7.37,29.15 0.7,35.81 0.7,45.59 2.73,47.62 2.73,56.77 1.59,57.91 1.59,60.58 7.62,66.61 VR2.2
  Bottom 0.127: IC3.3 10.41,29.34 10.35,29.4 8.13,29.4 v7.87,29.15
N$25
  Bottom 0.127: R22.2 12.89,8.76 12.89,10.1 12.06,10.92 IC1.1
N$26
  Bottom 0.127: R23.2 8.19,8.38 8.64,8.83 T3.C 8.64,8.76 R22.1
N$27
  Bottom 0.127: 19.94,52.07 19.94,54.61 C12.2 | R26.2 17.4,46.61 18.16,46.61 20.32,48.77 IC5.9 19.94,49.97 19.94,52.07 | 19.94,52.07 R33.1
N$28
  Bottom 0.127: IC5.7 IC5.6 | R26.1 17.4,44.39 | 17.4,44.39 R27.1 | R31.1 17.4,49.28 16.64,48.51 16.64,45.66 17.4,44.9 R26.1 | 17.4,44.39 IC5.7 | IC5.7 | 17.4,44.83 R26.1
N$29
  Bottom 0.127: R24.1 21.65,63.5 21.59,63.44 U$6.P$1
N$30  (via drill 0.3)
  Top 0.127: v19.05,53.85 19.05,55.24 18.67,55.63 v18.67,61.98
  Bottom 0.127: 24.07,68.58 R29.2 24.51,68.58 | 24.07,68.58 R32.2 | v19.05,53.85 19.05,51.56 19.56,51.05 19.56,48.39 19.11,47.94 17.4,47.94 R31.2 | v18.67,61.98 23.3,66.61 24.07,66.61 VR4.3 24.07,66.67 24.07,68.58
N$31
  Bottom 0.127: R30.2 26.35,39.62 26.35,38.67 25.21,37.53 T4.E
N$32
  Bottom 0.127: 27.3,35.62 27.3,36.51 27.37,36.58 T4.C 27.3,36.58 27.3,40.77 26.42,41.66 | 27.3,35.62 27.3,33.53 D4.A | 27.3,35.62 25.21,35.62 T4.B | 26.42,41.66 26.42,44.13 IC5.1 26.67,44.45 27.18,44.96 27.18,52.01 27.69,52.51 27.69,64.2 26.29,65.6 26.29,68.58 R29.1 | 26.42,41.66 R28.2
N$33  (via drill 0.3)
  Top 0.127: v18.54,42.99 18.54,43.81 22.04,47.31 23.88,47.31 v25.34,45.85
  Bottom 0.127: 24.7,41.66 24.7,39.62 R30.1 24.64,39.62 23.56,38.54 D4.C | v18.54,42.99 17.4,41.85 R27.2 | v25.34,45.85 25.34,44.51 25.4,44.45 IC5.2 25.4,43.56 24.7,42.86 24.7,41.66 | 24.7,41.66 R28.1
N$34
  Bottom 0.127: T5.2 19.05,38.61 16.38,41.27 16.38,50.29 17.37,51.28 | 17.37,51.28 18.16,52.07 R33.2 18.22,52.07 18.22,54.61 C12.1 | 17.37,51.28 IC5.8
N$35
  Bottom 0.127: T5.4 18.29,40.26 19.75,38.8 19.75,38.48 T5.1 19.75,38.42 19.49,38.16 19.49,35.56 R35.2
N$36
  Bottom 0.127: T5.6 19.81,40.26 21.84,40.26 22.35,39.75 R34.1 22.1,40.07 23.94,41.91 23.94,42.48 24.89,43.43 24.89,49.02 25.4,49.53 IC5.13 25.4,50.04 24.57,50.86 24.57,52.07 C13.2
N$37  (via drill 0.3)
  Top 0.127: v24.77,53.53 24.77,61.72 19.88,66.61 19.11,66.61 VR4.1
  Bottom 0.127: R35.1 21.21,35.56 21.21,35.18 22.73,33.66 22.73,33.08 22.86,32.96 24.26,32.96 24.38,33.08 24.38,34.92 24.26,35.05 24.26,38.1 25.02,38.86 25.27,38.86 25.65,39.24 25.65,42.93 26.16,43.43 26.16,49.02 26.67,49.53 IC5.14 26.29,49.97 26.29,52.07 C13.1 26.23,52.07 v24.77,53.53
N$38  (via drill 0.3)
  Top 0.127: v18.99,18.48 18.67,18.8 18.67,25.84 v22.8,29.97 | v23.37,31.05 23.37,32.89 24.51,34.04 24.51,39.62 24,40.13 23.05,40.13 21.59,41.59 U$7.P$1
  Bottom 0.127: R36.1 19.68,17.78 v18.99,18.48 | v22.8,29.97 22.8,30.48 v23.37,31.05
N$39
  Bottom 0.127: 19.68,13.46 R37.2 | IC1.14 19.68,13.46 | 19.68,13.46 R36.2
N$40  (via drill 0.3)
  Top 0.127: v19.24,16.32 19.24,18.1 v19.68,18.54
  Bottom 0.127: 21.72,21.78 19.68,21.78 R38.1 v19.68,18.54 | 21.72,21.78 22.29,22.35 R39.2 23.43,22.35 24.77,23.69 26.8,23.69 R40.2 | 21.72,21.78 C14.2 | IC1.13 17.65,14.73 v19.24,16.32
N$41
  Bottom 0.381: D2.C 9.08,96.71 C1.NEG2 9.21,96.58 9.53,96.27 C1.NEG1
N$42
  Bottom 0.381: D1.A 20.13,96.71 C1.POS2 20,96.58 19.68,96.27 C1.POS1
N$43  (via drill 0.3)
  Top 0.127: v27.81,30.86 28.57,31.62 28.57,64.39 24.13,68.83 24.13,80.58 VR3.3 | v23.75,27.88 23.75,25.59 v22.8,24.64
  Bottom 0.127: 19.68,23.43 21.72,23.43 C14.1 21.72,23.56 v22.8,24.64 | 19.68,23.43 19.68,23.11 18.54,21.97 18.54,16.89 17.65,16 IC1.12 | 19.68,23.43 R38.2 | v27.81,30.86 25.08,28.13 24,28.13 v23.75,27.88
N$44
  Bottom 0.127: R40.1 26.8,21.14 28.51,19.43 28.51,17.34 R41.2
N$45
  Bottom 0.127: R43.1 24.32,30.73 24.32,29.4 24.64,29.08 C15.2 24.32,29.34 22.04,29.34 21.97,29.27 19.56,29.27 | 19.56,29.27 18.86,29.27 17.65,28.07 IC3.13 | 19.56,29.27 R42.2
N$46  (via drill 0.3)
  Top 0.127: v15.62,30.1 15.62,33.53 10.54,38.61 10.54,39.62 9.4,40.77 7.24,40.77 6.54,41.47 6.54,43.31 14.1,50.86 22.73,50.86 25.21,53.34 25.21,64.07 22.61,66.67 22.61,79.57 21.59,80.58 VR3.2
  Bottom 0.127: IC3.12 16.38,29.34 v15.62,30.1
N$47
  Bottom 0.127: 18,26 IC3.14 | 18,26 18.41,25.59 18.41,25.15 R44.2 | 18,26 19.56,27.56 R42.1 19.56,27.62 19.81,27.88 23.11,27.88 23.62,27.37 24.64,27.37 C15.1
N$48
  Bottom 0.127: R48.1 18.03,6.6 18.03,6.35 19.43,4.95 R49.2 19.18,5.14 17.72,3.68 IC4.6
N$49
  Bottom 0.127: T6.B 16.7,36.2 16.7,34.86 17.14,34.42 IC3.8 IC3.9
N$50  (via drill 0.3)
  Top 0.127: v22.16,74.99 22.16,67.25 21.59,66.67 VR4.2
  Bottom 0.127: IC3.10 16.76,31.88 15.18,30.29 15.18,27.11 16,26.29 17.34,26.29 17.72,25.91 17.72,24.51 17.84,24.38 19.05,24.38 19.43,24.77 19.43,25.91 21.14,27.62 22.99,27.62 24.07,26.54 25.21,26.54 28.77,30.1 28.77,68.39 v22.16,74.99
N$51
  Bottom 0.127: R45.2 17.97,8.76 17.97,10.16 IC1.16
N$52  (via drill 0.3)
  Top 0.127: v15.81,12.89 15.81,29.65 16.07,29.91 16.07,33.47 15.3,34.23 v15.3,37.34
  Bottom 0.127: R46.2 14.99,39.24 15.75,38.48 T6.C 15.75,38.42 15.3,37.97 v15.3,37.34 | v15.81,12.89 15.81,10.6 16.26,10.16 16.26,8.76 R45.1
N$53
  Bottom 0.127: R52.2 9.65,1.27 11.87,1.27 IC4.1 12.06,1.14 12.57,1.65 18.16,1.65 19.43,2.92 R49.1
N$54
  Bottom 0.127: IC4.7 16.76,2.41 15.88,3.3 15.88,5.33 16.26,5.71 16.26,6.6 R48.2 16.32,6.6 17.08,7.37 17.97,7.37 19.75,9.14 22.73,9.14 R47.2
N$55
  Bottom 0.127: 5.97,4.32 5.97,3.05 | 5.97,3.05 5.97,2.29 R50.2 | 5.97,4.32 5.97,6.35 R53.2 | 5.97,4.32 R51.2 | IC4.2 11.43,2.98 9.65,2.98 R52.1 9.65,3.05 5.97,3.05
N$56
  Bottom 0.127: SJ3.2 8.13,55.44 U$1.P$2
N$57
  Bottom 0.127: U$2.P$1 7.62,10.73 6.54,9.65 5.84,9.65 5.21,9.02 5.21,8 4.25,7.05 4.25,6.35 R53.1
N$58
  Bottom 0.127: SJ4.2 21.08,55.44 U$6.P$2
REF_10
  Bottom 0.127: 14.86,79.18 16.51,79.18 R55.2 | 14.86,79.18 12.7,79.18 R54.1 | SJ4.1 14.35,57.15 | 14.35,57.15 SJ3.1 | 14.86,79.18 14.86,58.29 14.35,57.78 14.35,57.15

### Text on the board
Top: go vegan | ehre
bNames: based on befaco hexmix vca | 2VCA v1 | jhbruhn 2019 | FCK / AFD